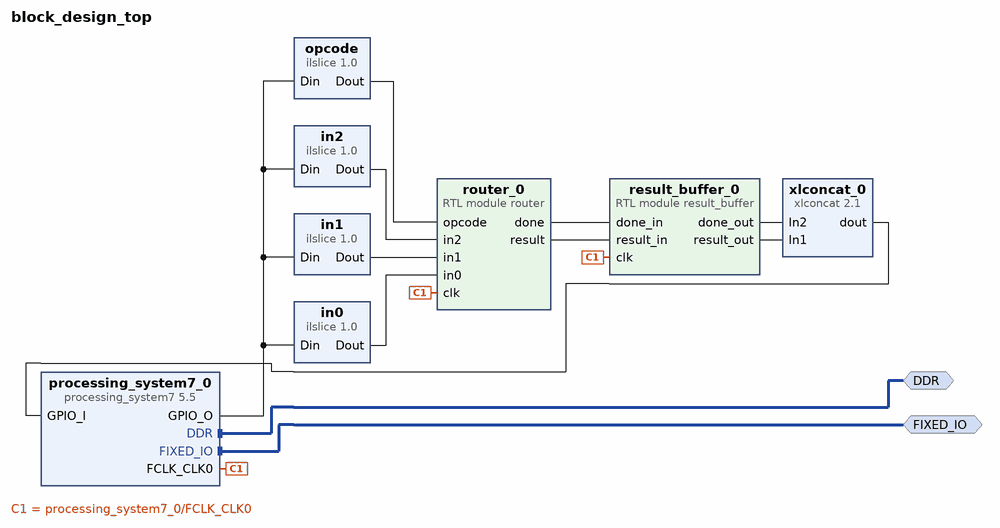
[diagram p0: block diagram of the top level]
# Vivado block design block_design_top, xc7z020clg400-1, Vivado 2025.2
create_bd_design block_design_top

create_bd_intf_port -mode Master -vlnv xilinx.com:interface:ddrx_rtl:1.0 DDR
create_bd_intf_port -mode Master -vlnv xilinx.com:display_processing_system7:fixedio_rtl:1.0 FIXED_IO

create_bd_cell -type ip -vlnv xilinx.com:ip:processing_system7:5.5 processing_system7_0
set_property -dict [list \
  CONFIG.PCW_APU_PERIPHERAL_FREQMHZ 666.666666 \
  CONFIG.PCW_ENET0_PERIPHERAL_ENABLE 0 \
  CONFIG.PCW_EN_RST0_PORT 0 \
  CONFIG.PCW_FPGA0_PERIPHERAL_FREQMHZ 50 \
  CONFIG.PCW_FPGA1_PERIPHERAL_FREQMHZ 50 \
  CONFIG.PCW_GPIO_EMIO_GPIO_ENABLE 1 \
  CONFIG.PCW_GPIO_EMIO_GPIO_IO 52 \
  CONFIG.PCW_GPIO_EMIO_GPIO_WIDTH 52 \
  CONFIG.PCW_GPIO_MIO_GPIO_ENABLE 1 \
  CONFIG.PCW_GPIO_MIO_GPIO_IO MIO \
  CONFIG.PCW_I2C_RESET_ENABLE 1 \
  CONFIG.PCW_PERIPHERAL_BOARD_PRESET part0 \
  CONFIG.PCW_PRESET_BANK1_VOLTAGE {LVCMOS 3.3V} \
  CONFIG.PCW_QSPI_PERIPHERAL_ENABLE 0 \
  CONFIG.PCW_SD0_PERIPHERAL_ENABLE 0 \
  CONFIG.PCW_UART1_PERIPHERAL_ENABLE 0 \
  CONFIG.PCW_UIPARAM_DDR_FREQ_MHZ 533.333333 \
  CONFIG.PCW_UIPARAM_DDR_PARTNO {MT41J128M8 JP-125} \
  CONFIG.PCW_USB0_PERIPHERAL_ENABLE 0 \
  CONFIG.PCW_USB_RESET_ENABLE 1 \
  CONFIG.PCW_USE_M_AXI_GP0 0 \
] [get_bd_cells processing_system7_0]
# 471 more settings of processing_system7_0 are not shown: defaults, MIO pin electricals, DDR timing, and values the tool derives
create_bd_cell -type inline_hdl -vlnv xilinx.com:inline_hdl:ilslice:1.0 in0
set_property -dict {CONFIG.DIN_FROM 7 CONFIG.DIN_TO 0 CONFIG.DIN_WIDTH 52} [get_bd_cells in0]
create_bd_cell -type inline_hdl -vlnv xilinx.com:inline_hdl:ilslice:1.0 in2
set_property -dict {CONFIG.DIN_FROM 23 CONFIG.DIN_TO 16 CONFIG.DIN_WIDTH 52} [get_bd_cells in2]
create_bd_cell -type inline_hdl -vlnv xilinx.com:inline_hdl:ilslice:1.0 opcode
set_property -dict {CONFIG.DIN_FROM 51 CONFIG.DIN_TO 49 CONFIG.DIN_WIDTH 52} [get_bd_cells opcode]
create_bd_cell -type module -reference router router_0
create_bd_cell -type inline_hdl -vlnv xilinx.com:inline_hdl:ilslice:1.0 in1
set_property -dict {CONFIG.DIN_FROM 15 CONFIG.DIN_TO 8 CONFIG.DIN_WIDTH 52} [get_bd_cells in1]
create_bd_cell -type module -reference result_buffer result_buffer_0
create_bd_cell -type ip -vlnv xilinx.com:ip:xlconcat:2.1 xlconcat_0
set_property -dict {CONFIG.IN0_WIDTH 24 CONFIG.IN1_WIDTH 24 CONFIG.IN3_WIDTH 3 CONFIG.NUM_PORTS 4} [get_bd_cells xlconcat_0]

# ---- connections ----

connect_bd_intf_net [get_bd_intf_ports DDR] [get_bd_intf_pins processing_system7_0/DDR]
connect_bd_intf_net [get_bd_intf_ports FIXED_IO] [get_bd_intf_pins processing_system7_0/FIXED_IO]
connect_bd_net -net Din_1 [get_bd_pins processing_system7_0/GPIO_O] \
  [get_bd_pins opcode/Din] [get_bd_pins in2/Din] [get_bd_pins in0/Din] [get_bd_pins in1/Din]
connect_bd_net -net clk_1 [get_bd_pins processing_system7_0/FCLK_CLK0] [get_bd_pins router_0/clk] [get_bd_pins result_buffer_0/clk]
connect_bd_net [get_bd_pins in0/Dout] [get_bd_pins router_0/in0]
connect_bd_net [get_bd_pins in1/Dout] [get_bd_pins router_0/in1]
connect_bd_net [get_bd_pins in2/Dout] [get_bd_pins router_0/in2]
connect_bd_net [get_bd_pins opcode/Dout] [get_bd_pins router_0/opcode]
connect_bd_net [get_bd_pins result_buffer_0/done_out] [get_bd_pins xlconcat_0/In2]
connect_bd_net [get_bd_pins result_buffer_0/result_out] [get_bd_pins xlconcat_0/In1]
connect_bd_net [get_bd_pins router_0/done] [get_bd_pins result_buffer_0/done_in]
connect_bd_net [get_bd_pins router_0/result] [get_bd_pins result_buffer_0/result_in]
connect_bd_net [get_bd_pins xlconcat_0/dout] [get_bd_pins processing_system7_0/GPIO_I]

validate_bd_design
save_bd_design
